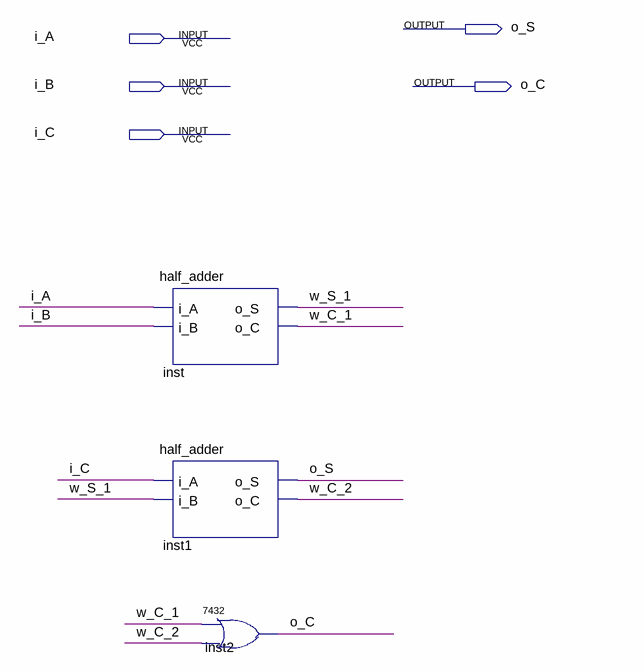
[diagram p0: schematic sheet]
// Quartus schematic full_adder.bdf as structural Verilog: 3 symbols, 5 pins
module full_adder (
  input  i_A,
  input  i_B,
  input  i_C,
  output o_S,
  output o_C
);

  wire w_C_1, w_C_2, w_S_1;

  half_adder inst (.i_A(i_A), .i_B(i_B), .o_S(w_S_1), .o_C(w_C_1));
  half_adder inst1 (.i_A(i_C), .i_B(w_S_1), .o_S(o_S), .o_C(w_C_2));
  \7432  inst2 (.\2 (w_C_1), .\3 (w_C_2), .\1 (o_C));
endmodule
